# EAGLE design LIMIT-INTERFACE (EAGLE 6.5.0)
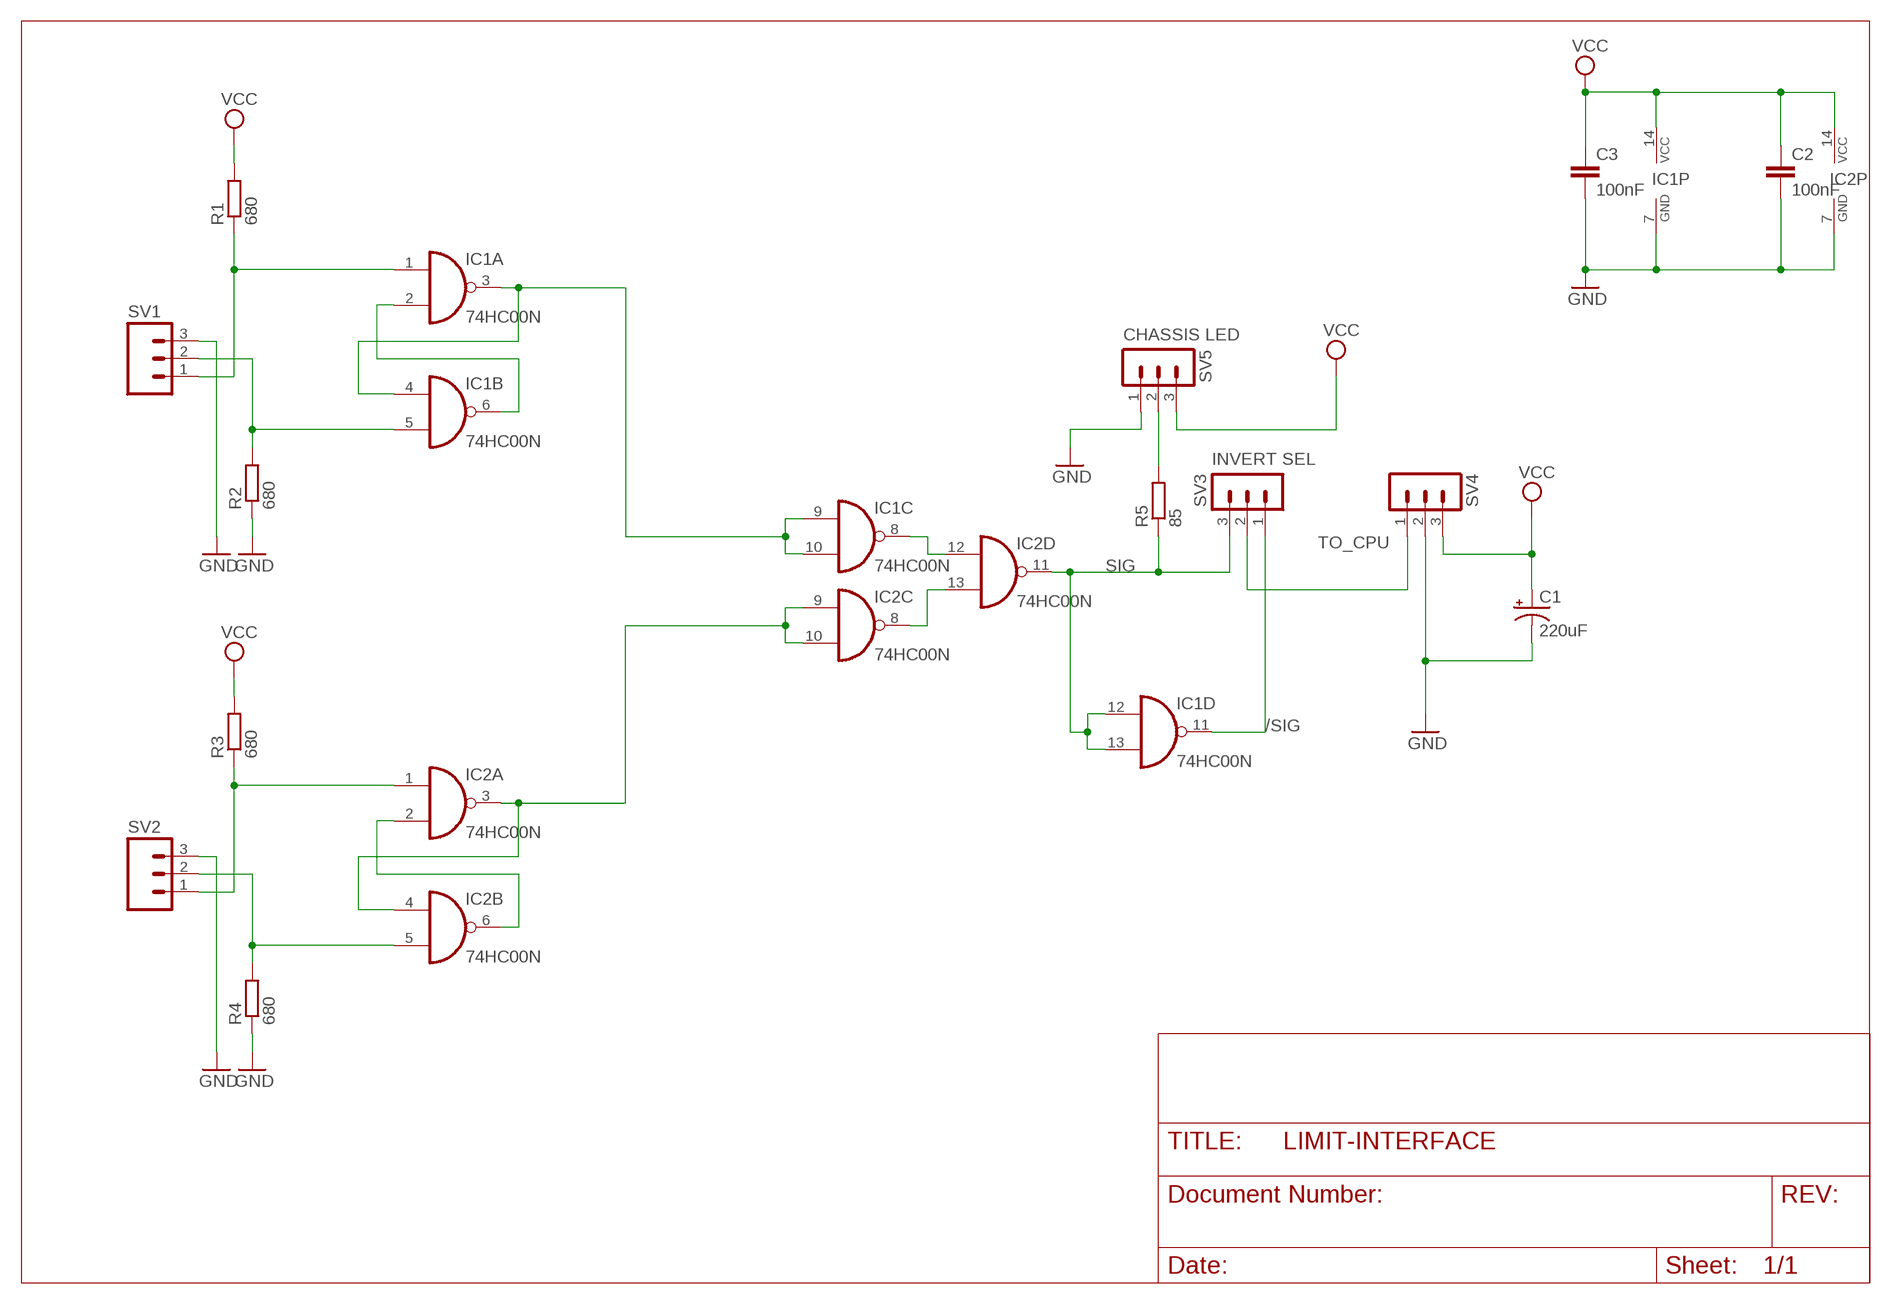
[diagram p0: schematic, sheet 1]

## Parts
C1  220uF  CAP_POLPTH4  [CPOL-RADIAL-1000UF-25V]
C2  100nF  CAPPTH  [CAP-PTH-SMALL]
C3  100nF  CAPPTH  [CAP-PTH-SMALL]
IC1  74HC00N  [DIL14]
IC2  74HC00N  [DIL14]
R1  680  R-EU_0207/7  [0207/7]
R2  680  R-EU_0207/5V  [0207/5V]
R3  680  R-EU_0207/7  [0207/7]
R4  680  R-EU_0207/5V  [0207/5V]
R5  85  R-EU_0207/10  [0207/10]
SV1  M03-SCREW-5MM  [SCREWTERMINAL-5MM-3]
SV2  M03-SCREW-5MM  [SCREWTERMINAL-5MM-3]
SV3  MA03-1  [MA03-1]
SV4  MA03-1  [MA03-1]
SV5  MA03-1  [MA03-1]

## Nets
/SIG: IC1.11(D:O) SV3.1
GND: C1.2(-) C2.2 C3.2 IC1.7(P:GND) IC2.7(P:GND) R2.1 R4.1 SV1.3 SV2.3 SV4.2 SV5.1
N$1: IC1.3(A:O) IC1.4(B:I0) IC1.9(C:I0) IC1.10(C:I1)
N$2: IC1.2(A:I1) IC1.6(B:O)
N$3: IC1.1(A:I0) R1.1 SV1.1
N$4: IC1.5(B:I1) R2.2 SV1.2
N$5: IC2.3(A:O) IC2.4(B:I0) IC2.9(C:I0) IC2.10(C:I1)
N$6: IC2.2(A:I1) IC2.6(B:O)
N$7: IC2.1(A:I0) R3.1 SV2.1
N$8: IC2.5(B:I1) R4.2 SV2.2
N$9: IC1.8(C:O) IC2.12(D:I0)
N$10: IC2.8(C:O) IC2.13(D:I1)
N$16: R5.2 SV5.2
SIG: IC1.12(D:I0) IC1.13(D:I1) IC2.11(D:O) R5.1 SV3.3
TO_CPU: SV3.2 SV4.1
VCC: C1.1(+) C2.1 C3.1 IC1.14(P:VCC) IC2.14(P:VCC) R1.2 R3.2 SV4.3 SV5.3

## Notes on the sheet
- CHASSIS LED
- INVERT SEL

## Library data of the parts
C1 = SparkFun-Passives:CAP_POL: Capacitor Polarized These are standard SMD and PTH capacitors. Normally 10uF, 47uF, and 100uF in electrolytic and tantalum varieties. Always verify the external diameter of the through hole cap, it varies with capacity, voltage, and manufacturer. The EIA devices should be standard.
C2 C3 = SparkFun-Capacitors:CAP: Capacitor Standard 0603 ceramic capacitor, and 0.1" leaded capacitor.
IC1 IC2 = 74xx-eu:74*00: Quad 2-input NAND gate
R1-R5 = rcl:R-EU_: RESISTOR, European symbol
SV1 SV2 = SparkFun-Connectors:M03: Header 3 Standard 3-pin 0.1" header. Use with straight break away headers (SKU : PRT-00116), right angle break away headers (PRT-00553), swiss pins (PRT-00743), machine pins (PRT-00117), and female headers (PRT-00115). Molex polarized connector foot print use with SKU : PRT-08232 with associated crimp pins and housings.; STOREFRONT_ID: PRT-08433
SV3-SV5 = con-lstb:MA03-1: PIN HEADER; OC_FARNELL: unknown; OC_NEWARK: unknown

## Board
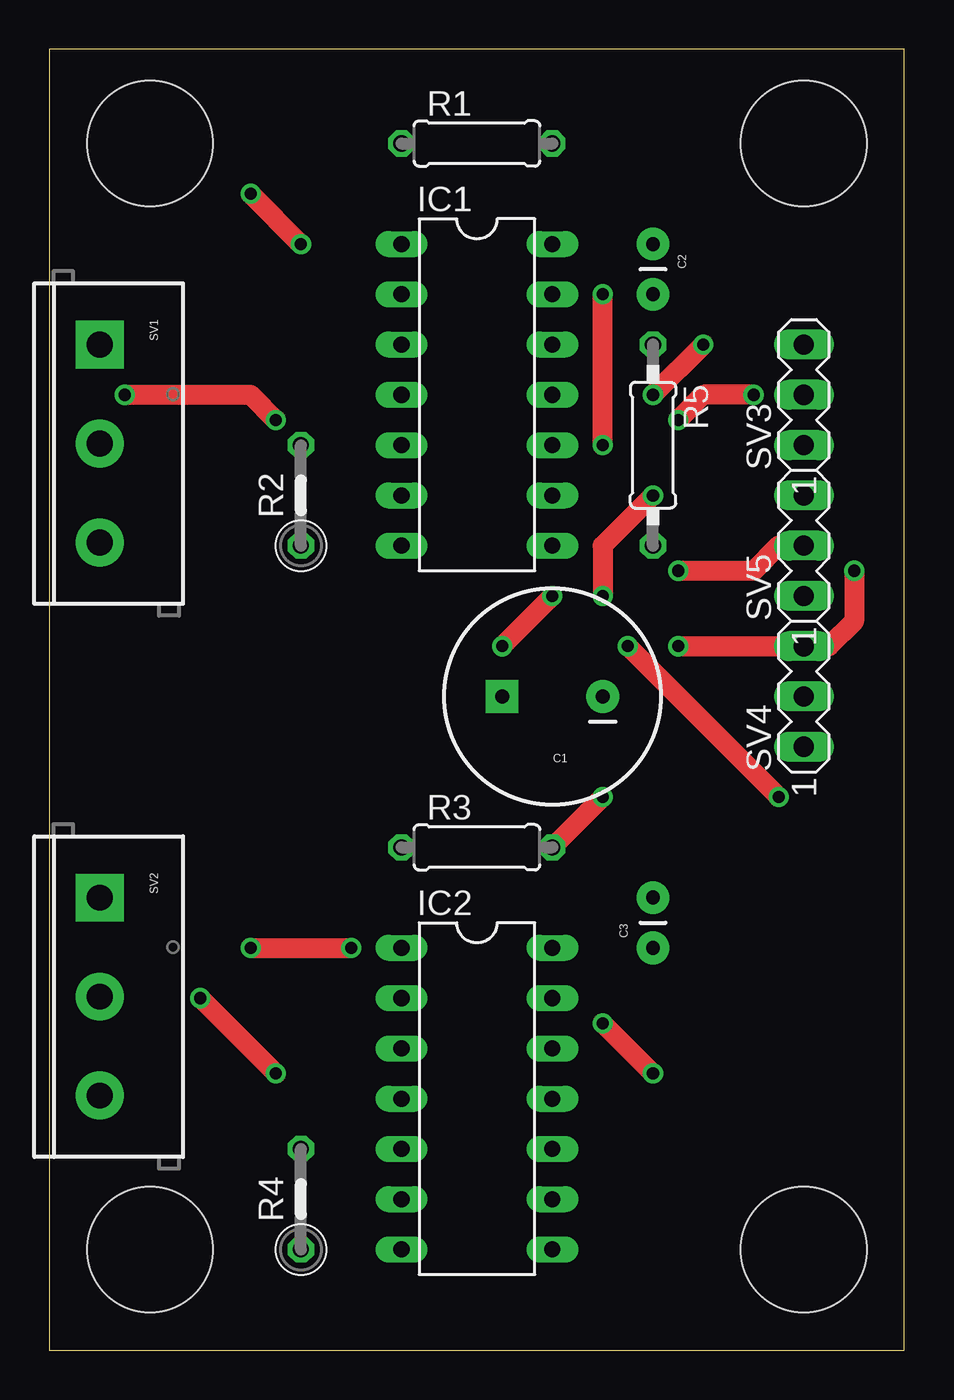
[diagram p1: board, top side]
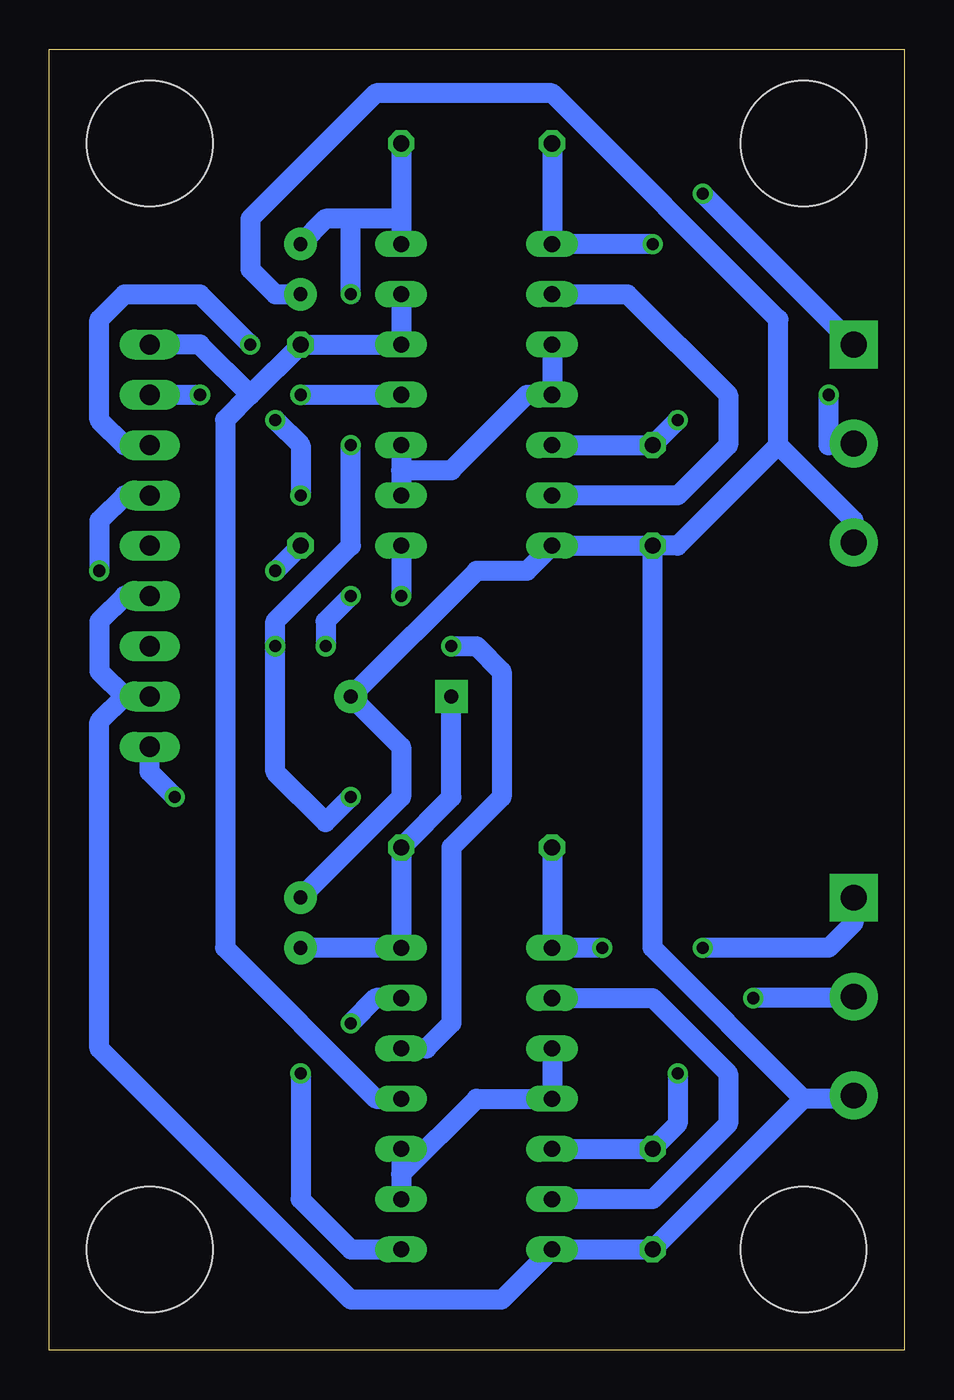
[diagram p2: board, bottom side, seen from below]

Size 43.16 x 65.71 mm. Coordinates in mm from the lower left corner, seen from the top.
Outline: 0,0 43.16,0 43.16,65.71 0,65.71 0,0
Copper layers (1*16): Top 0.035mm / dielectric 1.5mm / Bottom 0.035mm
Design rules "BasicHandEtching": minimum track width 40mil, minimum drill 24mil, track to track 20mil, track to pad 20mil, pad to pad 20mil, via to via 20mil, smd to smd 20mil, copper to edge 40mil, drill to drill 8mil, minimum pad ring 10mil, minimum via ring 8mil, stop-mask expansion 4mil, vias tented up to drill 0mil, thermal gap 20mil
Holes 6.35 mm at 5.08,5.08 38.1,5.08 38.1,60.96 5.08,60.96

### Footprints (pad centres in the part's own frame; a part is rotated, then mirrored left to right if it is on the bottom)
CPOL-RADIAL-1000UF-25V = drill 0.7 pad 1.651 square: 1 2.54,0 | drill 0.7 pad 1.651: 2 -2.54,0
CAP-PTH-SMALL = drill 0.7 pad 1.651: 1 0,0; 2 2.54,0
DIL14 = drill 0.813 long: 1 -7.62,-3.81; 2 -5.08,-3.81; 3 -2.54,-3.81; 4 0,-3.81; 5 2.54,-3.81; 6 5.08,-3.81; 7 7.62,-3.81; 8 7.62,3.81; 9 5.08,3.81; 10 2.54,3.81; 11 0,3.81; 12 -2.54,3.81; 13 -5.08,3.81; 14 -7.62,3.81
0207/7 = drill 0.813 octagon: 1 -3.81,0; 2 3.81,0
0207/5V = drill 0.813 octagon: 1 -2.54,0; 2 2.54,0
0207/10 = drill 0.813 octagon: 1 -5.08,0; 2 5.08,0
SCREWTERMINAL-5MM-3 = drill 1.3 pad 2.413 square: 1 0,0 | drill 1.3 pad 2.413: 2 5,0; 3 10,0
MA03-1 = drill 1.016 long: 1 -2.54,0; 2 0,0; 3 2.54,0

### Placement (x,y rotation side)
C1  25.4,33.02 180 top
C2  30.48,55.88 270 top
C3  30.48,20.32 90 top
IC1  21.59,48.26 270 top
IC2  21.59,12.7 270 top
R1  21.59,60.96 0 top
R2  12.7,43.18 90 top
R3  21.59,25.4 0 top
R4  12.7,7.62 90 top
R5  30.48,45.72 270 top
SV1  2.54,50.8 270 top
SV2  2.54,22.86 270 top
SV3  38.1,48.26 90 top
SV4  38.1,33.02 90 top
SV5  38.1,40.64 90 top

### Tracks (layer width: path | path; a pad name or v marks a point on that pad's centre or on a via)
/SIG  (via drill 0.61)
  Top 1.016: v33.02,50.8 v30.48,48.26
  Bottom 1.016: v30.48,48.26 IC1.11 | v33.02,50.8 35.56,53.34 39.37,53.34 40.64,52.07 40.64,46.99 39.37,45.72 SV3.1
GND
  Bottom 1.016: C3.2 25.4,27.94 25.4,30.48 C1.2 21.59,39.37 19.05,39.37 IC1.7 R2.1 | C2.2 31.75,53.34 33.02,54.61 33.02,57.15 26.67,63.5 17.78,63.5 6.35,52.07 6.35,45.72 | 6.35,45.72 2.54,41.91 SV1.3 | R2.1 11.43,40.64 6.35,45.72 | 39.37,33.02 40.64,34.29 40.64,36.83 39.37,38.1 SV5.1 | 5.08,12.7 R4.1 IC2.7 20.32,2.54 27.94,2.54 40.64,15.24 40.64,31.75 39.37,33.02 | 5.08,12.7 2.54,12.7 SV2.3 | 39.37,33.02 SV4.2 | R2.1 12.7,20.32 5.08,12.7
N$1
  Bottom 1.016: IC1.3 IC1.4 19.05,48.26 22.86,44.45 25.4,44.45 | IC1.10 25.4,44.45 | 25.4,44.45 IC1.9
N$2
  Bottom 1.016: IC1.6 11.43,43.18 8.89,45.72 8.89,48.26 13.97,53.34 IC1.2
N$3  (via drill 0.61)
  Top 1.016: v10.16,58.42 v12.7,55.88
  Bottom 1.016: R1.1 IC1.1 v12.7,55.88 | SV1.1 v10.16,58.42
N$4  (via drill 0.61)
  Top 1.016: v11.43,46.99 10.16,48.26 v3.81,48.26
  Bottom 1.016: IC1.5 R2.2 v11.43,46.99 | v3.81,48.26 3.81,45.72 2.54,45.72 SV1.2
N$5
  Bottom 1.016: IC2.3 IC2.4 21.59,12.7 25.4,8.89 | IC2.10 25.4,8.89 | 25.4,8.89 IC2.9
N$6
  Bottom 1.016: IC2.6 12.7,7.62 8.89,11.43 8.89,13.97 12.7,17.78 IC2.2
N$7  (via drill 0.61)
  Top 1.016: v10.16,20.32 v15.24,20.32
  Bottom 1.016: R3.1 IC2.1 v15.24,20.32 | v10.16,20.32 3.81,20.32 2.54,21.59 SV2.1
N$8  (via drill 0.61)
  Top 1.016: v7.62,17.78 v11.43,13.97
  Bottom 1.016: IC2.5 R4.2 11.43,11.43 v11.43,13.97 | v7.62,17.78 2.54,17.78 SV2.2
N$9  (via drill 0.61)
  Top 1.016: v25.4,38.1 v22.86,35.56
  Bottom 1.016: IC2.12 24.13,15.24 22.86,16.51 22.86,25.4 20.32,27.94 20.32,34.29 21.59,35.56 v22.86,35.56 | IC1.8 v25.4,38.1
N$10  (via drill 0.61)
  Top 1.016: v27.94,16.51 v30.48,13.97
  Bottom 1.016: IC2.8 27.94,5.08 30.48,7.62 v30.48,13.97 | v27.94,16.51 26.67,17.78 IC2.13
N$16  (via drill 0.61)
  Top 1.016: v31.75,39.37 35.56,39.37 36.83,40.64 SV5.2
  Bottom 1.016: v31.75,39.37 R5.2
SIG
  Bottom 1.016: IC1.13 IC1.12 R5.1 33.02,48.26 | IC2.11 26.67,12.7 34.29,20.32 34.29,46.99 33.02,48.26 | SV3.3 35.56,50.8 33.02,48.26
TO_CPU  (via drill 0.61)
  Top 1.016: v29.21,35.56 v36.83,27.94 | v27.94,38.1 27.94,40.64 v30.48,43.18 | v31.75,46.99 33.02,48.26 v35.56,48.26
  Bottom 1.016: SV4.1 38.1,29.21 v36.83,27.94 | v29.21,35.56 29.21,36.83 v27.94,38.1 | v30.48,43.18 30.48,45.72 v31.75,46.99 | SV3.2 v35.56,48.26
VCC  (via drill 0.61)
  Top 1.016: v40.64,39.37 40.64,36.83 39.37,35.56 SV4.3 v31.75,35.56 | R3.2 v27.94,27.94 | v27.94,45.72 v27.94,53.34
  Bottom 1.016: R1.2 25.4,57.15 | 25.4,57.15 IC1.14 | C2.1 29.21,57.15 27.94,57.15 | 25.4,57.15 27.94,57.15 | v40.64,39.37 40.64,41.91 39.37,43.18 SV5.3 | C3.1 IC2.14 R3.2 22.86,27.94 C1.1 | v27.94,27.94 29.21,26.67 31.75,29.21 v31.75,35.56 31.75,36.83 27.94,40.64 v27.94,45.72 | v27.94,53.34 27.94,57.15